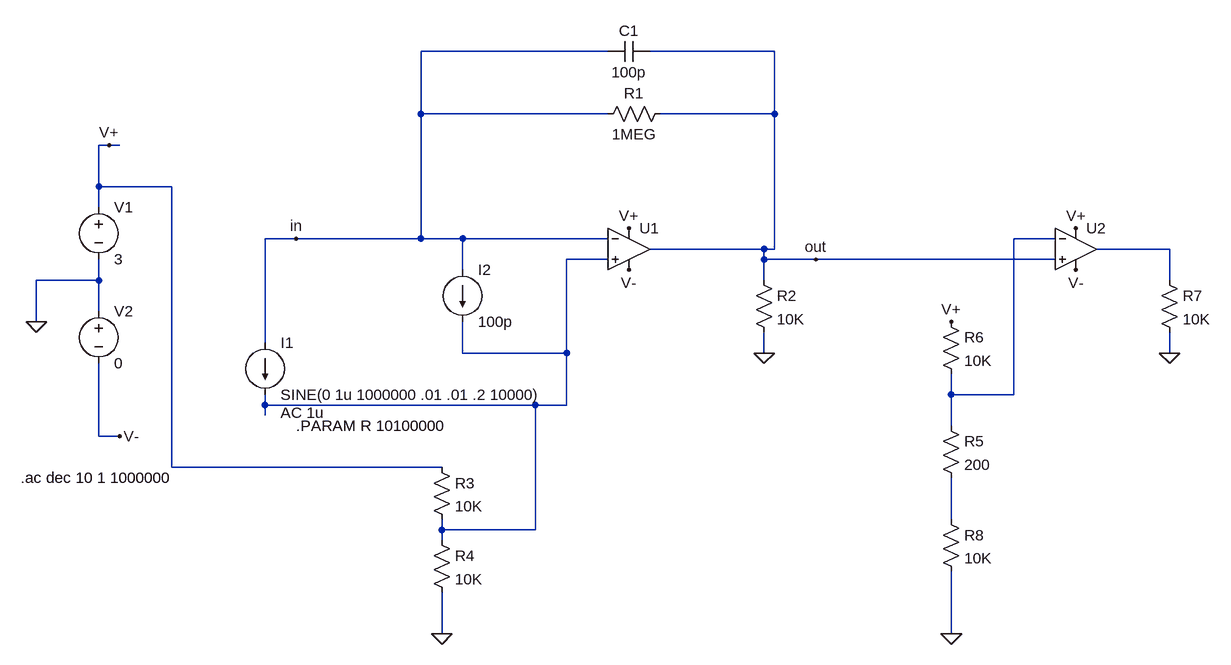
[diagram p0: schematic DasBlinkinput.asc]
DasBlinkinput.asc, the LTspice schematic file:
Version 4
SHEET 1 1480 724
WIRE 544 -192 256 -192
WIRE 800 -192 608 -192
WIRE 256 -96 256 -192
WIRE 544 -96 256 -96
WIRE 800 -96 800 -192
WIRE 800 -96 624 -96
WIRE -224 -48 -240 -48
WIRE -208 -48 -224 -48
WIRE -240 16 -240 -48
WIRE -128 16 -240 16
WIRE -240 48 -240 16
WIRE 64 96 16 96
WIRE 256 96 256 -96
WIRE 256 96 64 96
WIRE 320 96 256 96
WIRE 544 96 320 96
WIRE 1232 96 1168 96
WIRE 784 112 608 112
WIRE 800 112 800 -96
WIRE 800 112 784 112
WIRE 1408 112 1296 112
WIRE 544 128 480 128
WIRE 784 128 784 112
WIRE 864 128 784 128
WIRE 1232 128 864 128
WIRE 320 144 320 96
WIRE -240 160 -240 128
WIRE -240 160 -336 160
WIRE 784 160 784 128
WIRE 1408 160 1408 112
WIRE -240 208 -240 160
WIRE -336 224 -336 160
WIRE 16 256 16 96
WIRE 320 272 320 224
WIRE 480 272 480 128
WIRE 480 272 320 272
WIRE 784 272 784 240
WIRE 1408 272 1408 240
WIRE 1072 336 1072 304
WIRE 1168 336 1168 96
WIRE 1168 336 1072 336
WIRE 16 352 16 336
WIRE 432 352 16 352
WIRE 480 352 480 272
WIRE 480 352 432 352
WIRE 16 368 16 352
WIRE 1072 384 1072 336
WIRE -240 400 -240 288
WIRE -208 400 -240 400
WIRE -128 448 -128 16
WIRE 288 448 -128 448
WIRE 1072 528 1072 464
WIRE 288 544 288 528
WIRE 432 544 432 352
WIRE 432 544 288 544
WIRE 288 560 288 544
WIRE 288 704 288 640
WIRE 1072 704 1072 608
FLAG -224 -48 V+
FLAG -208 400 V-
FLAG -336 224 0
FLAG 784 272 0
FLAG 576 80 V+
FLAG 576 144 V-
FLAG 288 704 0
FLAG 1264 80 V+
FLAG 1264 144 V-
FLAG 1072 224 V+
FLAG 1408 272 0
FLAG 1072 704 0
FLAG 64 96 in
FLAG 864 128 out
SYMBOL voltage -240 32 R0
WINDOW 123 0 0 Left 2
WINDOW 39 0 0 Left 2
SYMATTR InstName V1
SYMATTR Value 3
SYMBOL Opamps\\UniversalOpamp2 576 112 R0
SYMATTR InstName U1
SYMATTR Value2 Avol=100K GBW=1MEG Slew=500K
SYMBOL current 16 256 R0
WINDOW 123 24 108 Left 2
WINDOW 39 0 0 Left 2
SYMATTR Value2 AC 1u
SYMATTR InstName I1
SYMATTR Value SINE(0 1u 1000000 .01 .01 .2 10000)
SYMBOL res 640 -112 R90
WINDOW 0 0 56 VBottom 2
WINDOW 3 32 56 VTop 2
SYMATTR InstName R1
SYMATTR Value 1MEG
SYMBOL voltage -240 192 R0
WINDOW 123 0 0 Left 2
WINDOW 39 0 0 Left 2
SYMATTR InstName V2
SYMATTR Value 0
SYMBOL res 768 144 R0
SYMATTR InstName R2
SYMATTR Value 10K
SYMBOL current 320 144 R0
WINDOW 123 0 0 Left 2
WINDOW 39 0 0 Left 2
SYMATTR InstName I2
SYMATTR Value 100p
SYMBOL res 272 432 R0
SYMATTR InstName R3
SYMATTR Value 10K
SYMBOL res 272 544 R0
SYMATTR InstName R4
SYMATTR Value 10K
SYMBOL Opamps\\UniversalOpamp2 1264 112 R0
SYMATTR InstName U2
SYMATTR Value2 Avol=100K GBW=1MEG Slew=500K
SYMBOL res 1056 368 R0
SYMATTR InstName R5
SYMATTR Value 200
SYMBOL res 1056 208 R0
SYMATTR InstName R6
SYMATTR Value 10K
SYMBOL res 1392 144 R0
SYMATTR InstName R7
SYMATTR Value 10K
SYMBOL res 1056 512 R0
SYMATTR InstName R8
SYMATTR Value 10K
SYMBOL cap 608 -208 R90
WINDOW 0 0 32 VBottom 2
WINDOW 3 32 32 VTop 2
SYMATTR InstName C1
SYMATTR Value 100p
TEXT -360 464 Left 2 !.ac dec 10 1 1000000
TEXT 64 384 Left 2 !.PARAM R 10100000

The netlist it stands for:
* DasBlinkinput.asc
V1 V+ 0 3
XU1 N003 in V+ V- out level.2 Avol=100K GBW=1MEG Slew=500K ilimit=25m rail=0 Vos=0 phimargin=45 en=0 enk=0 in=0 ink=0 Rin=500Meg  ; pins IN+ IN- V+ V- OUT
I1 in N003 SINE(0 1u 1000000 .01 .01 .2 10000) AC 1u
R1 out in 1MEG
V2 0 V- 0
R2 out 0 10K
I2 in N003 100p
R3 V+ N003 10K
R4 N003 0 10K
XU2 out N001 V+ V- N002 level.2 Avol=100K GBW=1MEG Slew=500K ilimit=25m rail=0 Vos=0 phimargin=45 en=0 enk=0 in=0 ink=0 Rin=500Meg  ; pins IN+ IN- V+ V- OUT
R5 N001 N004 200
R6 V+ N001 10K
R7 N002 0 10K
R8 N004 0 10K
C1 out in 100p
.ac dec 10 1 1000000
.PARAM R 10100000
.lib UniversalOpamps2.sub
.backanno
.end